# Altium schematic sheet Power.SchDoc
size A4; SheetNumber: 5; SheetTotal: 5
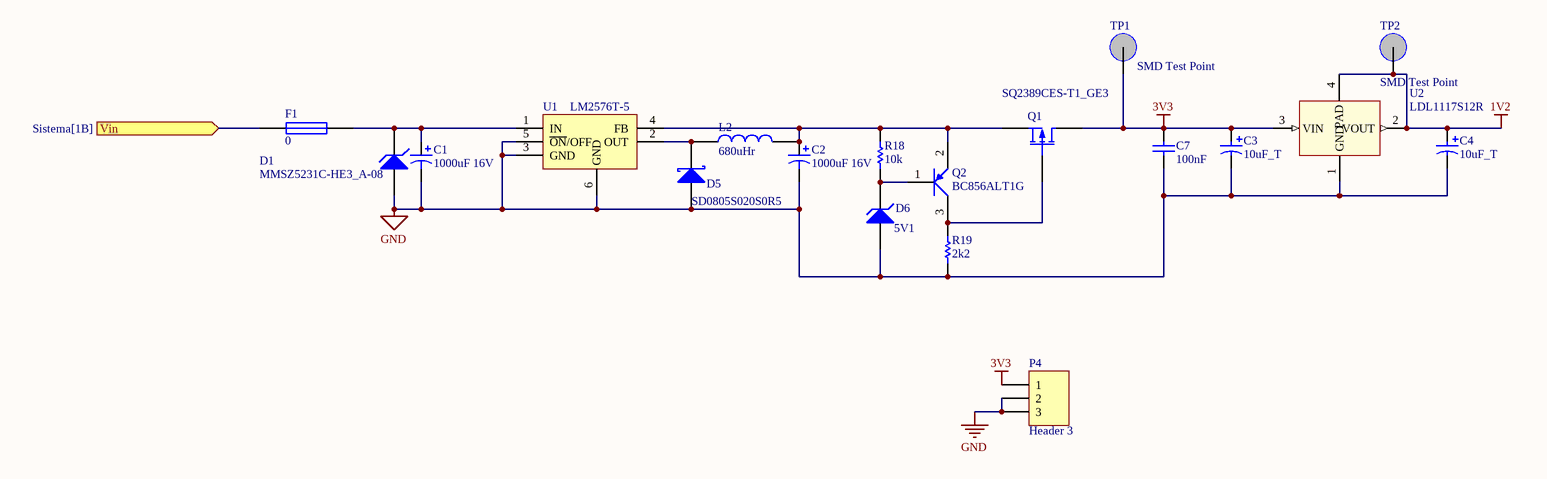
[diagram p0: Power.SchDoc]

## Parts
C1  1000uF 16V  [C_SMD_F12]
C2  1000uF 16V  [C_SMD_F12]
C3  10uF_T  [C_0805_2013_c]
C4  10uF_T  [C_0805_2013_c]
C7  100nF  [C_0805_2013_b]
D1  MMSZ5231C-HE3_A-08  [D_SOD-123]
D5  SD0805S020S0R5  [D_SOD-123]
D6  5V1  [D_SOD-123]
F1  0  [F_0805_2012]
L2  680uHr  [L_SMD_10x10]
P4  Header 3  [P_HDR1X3_3D]
Q1  SQ2389CES-T1_GE3  [Q_SOT-23]
Q2  BC856ALT1G  [Q_SOT-23B_N]
R18  10k  [R_0805_2012_a]
R19  2k2  [R_0805_2012_a]
TP1  SMD Test Point  [TP SMD]
TP2  SMD Test Point  [TP SMD]
U1  LM2576T-5  [U_SMD_TO-263-5]
U2  LDL1117S12R  [U_SOT-223]

## Ports
Vin (in, see Sistema[1B])

## Nets
1V2: C4.1 TP2.1 U2.2(VOUT) U2.4(PAD)
3V3: C3.1 C7.2 P4.1 Q1.3(D) TP1.1 U2.3(VIN)
GND: C1.2 C2.2 C3.2 C4.2 C7.1 D1.2(A) D5.2(A) D6.2(A) P4.2 P4.3 R19.2 U1.3(GND) U1.5(~{O}~{N}/OFF) U1.6(GND) U2.1(GND)
Vin: F1.1 ; port Vin
NetC1_1: C1.1 D1.1(K) F1.2 U1.1(IN)
NetC2_1: C2.1 L2.2 Q1.2(S) Q2.2(E) R18.2 U1.4(FB)
NetD5_1: D5.1(K) L2.1 U1.2(OUT)
NetD6_1: D6.1(K) Q2.1(B) R18.1
NetQ1_1: Q1.1(G) Q2.3(C) R19.1

## Library data of the parts
C1 C2 = C_1000uF_16V_p: Capacitor SMD Elec F12; Manufacturer: KEMET; Manufacturer Part Number: A768MS108M1CLAE015; Supplier 1: Mouser; Supplier Part Number 1: 80-A768MS108M1CLAE15; RoHS: Yes; Category: Polymer Capacitors; Stock 1: 5839; Pricing 1: 1=0,91, 10=0,572, 50=0,572, 100=0,466, 1000=0,307, 10000=0,275 (USD); Value: 1000uF 16V
C3 C4 = C_10uF_10V_b: Capacitor SMD 0805 Tant; Manufacturer: Vishay; Manufacturer Part Number: TMCP1A106MTRF; RoHS Compliant: Yes; Supplier 1: Mouser; Supplier Part Number 1: 74-TMCP1A106MTRF; RoHS: Yes; Category: Tantalum Capacitors; Stock 1: 7293; Pricing 1: 1=0,3, 10=0,152, 50=0,152, 100=0,098, 1000=0,082, 10000=0,067 (USD); Value: 10uF_T
C7 = C_100nF_50V_b: Capacitor SMD 0805; Manufacturer: Yageo; Manufacturer Part Number: CC0805KRX7R9BB104; Material: Ceramic; Tolerance: 10%; Dielectric: X7R; Voltage: 50V; Insulation Resistance: 100GR; Mounting Technology: Surface Mount; Case/Package: 0805; Pins: 2; Case Code (Metric): 2012; Case Code (Imperial): 0805; Min Operating Temperature: -55°C; Max Operating Temperature: 125°C; Packaging: Tape and Reel; Voltage Rating: 50V; Package Quantity: 4000; Termination: SMD/SMT; Series: CC; Length: 2mm; Height: 0.85mm; Depth: 1.25mm; Radiation Hardening: No; RoHS Compliant: Yes; Reach SVHC Compliant: No; Halogen Free: 5694HalogenFree; Lead Free: 5697LeadFree; ComponentLink1URL: https://datasheet.ciiva.com/11786/0900766b80d84f1d-11786009.pdf?src-supplier=Rs; ComponentLink1Description: https://datasheet.ciiva.com/11786/0900766b80d84f1d-11786009.pdf?src-supplier=Rs; ComponentLink2URL: https://datasheet.ciiva.com/46393/1734573-46393307.pdf?src-supplier=Element14; ComponentLink2Description: https://datasheet.ciiva.com/46393/1734573-46393307.pdf?src-supplier=Element14; ComponentLink3URL: https://datasheet.ciiva.com/155/mlccorderingcode-155930.pdf?src-supplier=Digikey; ComponentLink3Description: https://datasheet.ciiva.com/155/mlccorderingcode-155930.pdf?src-supplier=Digikey; ComponentLink4URL: https://datasheet.ciiva.com/155/mlccorderingcode-155929.pdf?src-supplier=Digikey; ComponentLink4Description: https://datasheet.ciiva.com/155/mlccorderingcode-155929.pdf?src-supplier=Digikey; ComponentLink5URL: https://datasheet.ciiva.com/155/mlccorderingcode-155931.pdf?src-supplier=Digikey; ComponentLink5Description: https://datasheet.ciiva.com/155/mlccorderingcode-155931.pdf?src-supplier=Digikey; ComponentLink6URL: https://datasheet.ciiva.com/11464/upy-gphc-x7r-6-3v-to-50v-8-11464757.pdf?src-supplier=Avnet; ComponentLink6Description: https://datasheet.ciiva.com/11464/upy-gphc-x7r-6-3v-to-50v-8-11464757.pdf?src-supplier=Avnet; ComponentLink7URL: https://datasheet.ciiva.com/28450/1489800-28450805.pdf?src-supplier=Element14; ComponentLink7Description: https://datasheet.ciiva.com/28450/1489800-28450805.pdf?src-supplier=Element14; ComponentLink8URL: https://datasheet.ciiva.com/29242/445210-da-01-en-kerko-chip-0805-x7r-0-1uf-10proz-50vg-29242074.pdf?src-supplier=Conrad; ComponentLink8Description: https://datasheet.ciiva.com/29242/445210-da-01-en-kerko-chip-0805-x7r-0-1uf-10proz-50vg-29242074.pdf?src-supplier=Conrad; Supplier 1: Digikey; Supplier Part Number 1: 311-1140-1-ND; RoHS: Yes; Category: Ceramic Capacitors; Stock 1: 5306374; Pricing 1: 1=0,1, 10=0,07, 50=0,0418, 100=0,0329, 500=0,02428, 1000=0,0201 (USD); Value: 100nF
D1 = D_MMSZ5231C-HE3_A-08: Diode SMD SOD-123 Zener 5V1; Manufacturer: Vishay Semiconductors; Manufacturer Part Number: MMSZ5226C-E3-08; Zener Voltage: 3.3V; Max Power Dissipation: 500mW; Impedance: 28R; Zener Current: 20mA; Voltage Tolerance: 2%; Max Reverse Leakage Current: 25uA; Mounting Technology: Surface Mount; Weight: 0.000363oz; Min Operating Temperature: -55°C; Max Operating Temperature: 150°C; Packaging: Tape and Reel; Package Quantity: 3000; Power Dissipation: 500mW; Tolerance: 2%; Series: Automotive, AEC-Q101; RoHS Compliant: Yes; ComponentLink1URL: https://www.vishay.com/docs/86344/mmsz5225_to_mmsz5267.pdf; ComponentLink1Description: Datasheet; RoHS: Yes; Category: Zener Diodes; Stock 1: 14347; Pricing 1: 1=0,29, 10=0,198, 50=0,198, 100=0,089, 1000=0,062, 10000=0,041 (USD); Value: MMSZ5231C-HE3_A-08; Supplier 1: Mouser; Supplier Part Number 1: 78-MMSZ5231CHE3_A-08
D5 = D_SD0805S020S0R5: Diode SMD D_SD0805S020S0R5; Manufacturer: Diodes; Manufacturer Part Number: B550C-13-F; Max Reverse Current: 500uA; Forward Current: 5A; Max Repetitive Reverse Voltage (Vrrm): 50V; Peak Non-Repetitive Surge Current: 100A; Polarity: Standard; Forward Voltage: 700mV; Mounting Technology: Surface Mount; Case/Package: SMC; Pins: 2; Weight: 0.007408oz; Contact Plating: Tin,Matte; Min Operating Temperature: -55°C; Max Operating Temperature: 125°C; Package Quantity: 3000; Packaging: Tape and Reel; Current Rating: 5A; Output Current: 5A; Series: -; Average Rectified Current: 5A; Max Forward Surge Current (Ifsm): 100A; Termination: SMD/SMT; Voltage Rating (DC): 50V; Max Reverse Voltage (DC): 50V; Length: 7.11mm; Width: 6.22mm; Height: 2.5mm; Radiation Hardening: No; Lead Free: Lead Free; RoHS Compliant: Yes; Reach SVHC Compliant: No; RoHS: Yes; Category: Rectifier Diodes; Stock 1: 65197; Pricing 1: 1=0,56, 10=0,476, 100=0,3309, 500=0,25834, 1000=0,20998 (USD); Value: SD0805S020S0R5; Supplier 1: Digikey; Supplier Part Number 1: 478-7799-1-ND
D6 = D_DDZ5V1B-7: Zener Diode; Manufacturer: Diodes; Max Power Dissipation: 500mW; Zener Voltage: 5.1V; Max Reverse Leakage Current: 5uA; Tolerance: 3%; Forward Voltage: 900mV; Impedance: 17R; Test Current: 20mA; Output Current: 40mA; Mounting Technology: Surface Mount; Case/Package: SOD-123-2; Pins: 2; Weight: 0.000353oz; Min Operating Temperature: -65°C; Max Operating Temperature: 150°C; Package Quantity: 3000; Packaging: Tape and Reel; Voltage Tolerance: 3%; Power Rating: 500mW; Series: -; Zener Current: 5uA; Max Reverse Current: 5uA; Power Dissipation: 500mW; Working Voltage: 5.1V; Termination: SMD/SMT; Voltage Rating (DC): 5.1V; Length: 3.85mm; Width: 1.7mm; Height: 1.35mm; Radiation Hardening: No; RoHS Compliant: Yes; Lead Free: Lead Free; ComponentLink1URL: http://components.arrow.com/part/dataview/41508659S7354897N2868?src-supplier=Arrow+Electronics; ComponentLink1Description: http://components.arrow.com/part/dataview/41508659S7354897N2868?src-supplier=Arrow+Electronics; ComponentLink2URL: http://www.mouser.com/ds/2/115/ds30407-71565.pdf?src-supplier=Mouser; ComponentLink2Description: http://www.mouser.com/ds/2/115/ds30407-71565.pdf?src-supplier=Mouser; ComponentLink3URL: http://www.diodes.com///datasheets/ds30407.pdf?src-supplier=Avnet; ComponentLink3Description: http://www.diodes.com///datasheets/ds30407.pdf?src-supplier=Avnet; ComponentLink4URL: http://www.diodes.com//datasheets/ds30407.pdf?src-supplier=Avnet; ComponentLink4Description: http://www.diodes.com//datasheets/ds30407.pdf?src-supplier=Avnet; ComponentLink5URL: https://datasheet.octopart.com/DDZ5V1B-7-Diodes-Inc.-datasheet-160462869.pdf?src-supplier=Farnell; ComponentLink5Description: https://datasheet.octopart.com/DDZ5V1B-7-Diodes-Inc.-datasheet-160462869.pdf?src-supplier=Farnell; ComponentLink6URL: http://www.diodes.com/_files/datasheets/ds30407.pdf?src-supplier=Future+Electronics; ComponentLink6Description: http://www.diodes.com/_files/datasheets/ds30407.pdf?src-supplier=Future+Electronics; ComponentLink7URL: https://www.diodes.com/assets/Datasheets/Ds30407.pdf?src-supplier=Digikey; ComponentLink7Description: https://www.diodes.com/assets/Datasheets/Ds30407.pdf?src-supplier=Digikey; ComponentLink8URL: https://datasheet.octopart.com/DDZ5V1B-7-Diodes-Inc.-datasheet-22952792.pdf?src-supplier=Future+Electronics; ComponentLink8Description: https://datasheet.octopart.com/DDZ5V1B-7-Diodes-Inc.-datasheet-22952792.pdf?src-supplier=Future+Electronics; ComponentLink9URL: https://www.verical.com/server-webapp/html/getDatasheet?partID=95733&src-supplier=Verical; ComponentLink9Description: https://www.verical.com/server-webapp/html/getDatasheet?partID=95733&src-supplier=Verical; Supplier 1: Digikey; Supplier Part Number 1: DDZ5V1BDICT-ND; Manufacturer Part Number: DDZ5V1B-7; RoHS: Yes; Category: Zener Diodes; Stock 1: 88257; Pricing 1: 1=0,25, 10=0,172, 100=0,084, 500=0,07006, 1000=0,04868 (USD); Supplier 2: Mouser; Supplier Part Number 2: 621-DDZ5V1B-7; Stock 2: 108934; Pricing 2: 1=0,24, 10=0,161, 50=0,161, 100=0,084, 1000=0,048, 10000=0,028 (USD); Value: 5V1
F1 = F_?_0805: (Generico) Fuse SMD 0805; Origin: TAIWAN; Published: 8-Jun-2000; LatestRevisionDate: 17-Jul-2002; LatestRevisionNote: Re-released for DXP Platform.; PackageReference: PIN-W2/E2.8; Publisher: Altium Limited; PackageDescription: Thru-Hole; 2 Leads; Supplier 1: Digi-Key; Supplier Part Number 1: SF-1206S200-2CT-ND; Value: 0
L2 = L_?_5: (Generico)  Inductor SMD 10x10; Value: 0
P4 = P_Header 3: Header, 3-Pin; Value: Header 3
Q1 = Q_SQ2389CES-T1_GE3: Value: SQ2389CES-T1_GE3; Supplier 1: Mouser; Supplier Part Number 1: 78-SQ2389CES-T1_GE3
Q2 = Q_BC856: TRANS PNP 65V 0.1A SOT23; Manufacturer: ON Semiconductor; Max Power Dissipation: 300mW; Max Collector Current: 100mA; Transition Frequency: 100MHz; Emitter Base Voltage (VEBO): 5V; Collector Base Voltage (VCBO): 80V; Collector Emitter Saturation Voltage: -650mV; Collector-emitter Voltage-Max: 650mV; hFE Min: 125; Number of Elements: 1; Voltage Rating (DC): -65V; Current Rating: -100mA; ComponentLink1Description: Manufacturer Link; ComponentLink1URL: http://www.fairchildsemi.com/; ComponentLink2Description: Datasheet; ComponentLink2URL: http://www.fairchildsemi.com/ds/2N%2F2N3904.pdf; Case/Package: SOT-23-3; Pins: 3; Contact Plating: Tin,Matte; Min Operating Temperature: -55°C; Max Operating Temperature: 150°C; Package Quantity: 3000; Packaging: Tape and Reel; Collector Emitter Breakdown Voltage: 65V; Polarity: PNP; Clock Frequency: 100MHz; Gain Bandwidth Product: 100MHz; Series: -; Collector Emitter Voltage (VCEO): 65V; Frequency: 100MHz; Max Breakdown Voltage: 65V; Power Dissipation: 300mW; Length: 2.9mm; Width: 1.3mm; Height: 0.94mm; Radiation Hardening: No; Lead Free: Lead Free; RoHS Compliant: Yes; Reach SVHC Compliant: No; ComponentLink3URL: http://www.farnell.com/datasheets/1840529.pdf?src-supplier=Farnell; ComponentLink3Description: http://www.farnell.com/datasheets/1840529.pdf?src-supplier=Farnell; ComponentLink4URL: http://www.alliedelec.com/m/d/ae2fff4c1f3549b23e4cd9e6cc054b51.pdf?src-supplier=Allied+Electronics; ComponentLink4Description: http://www.alliedelec.com/m/d/ae2fff4c1f3549b23e4cd9e6cc054b51.pdf?src-supplier=Allied+Electronics; ComponentLink5URL: http://www.mouser.com/ds/2/308/BC856ALT1-D-249456.pdf?src-supplier=Mouser; ComponentLink5Description: http://www.mouser.com/ds/2/308/BC856ALT1-D-249456.pdf?src-supplier=Mouser; ComponentLink6URL: http://www.farnell.com/datasheets/1840529.pdf?src-supplier=Element14; ComponentLink6Description: http://www.farnell.com/datasheets/1840529.pdf?src-supplier=Element14; ComponentLink7URL: http://www.farnell.com/datasheets/1840529.pdf?src-supplier=Newark; ComponentLink7Description: http://www.farnell.com/datasheets/1840529.pdf?src-supplier=Newark; Supplier Part Number 1: 863-BC856ALT1G; Manufacturer Part Number: BC856ALT1G; RoHS: Yes; Category: BJTs; Stock 1: 30566; Pricing 1: 1=0,11, 10=0,071, 50=0,071, 100=0,034, 1000=0,021, 10000=0,015 (USD); Value: BC856ALT1G; Supplier 1: Mouser
R18 = R_10k_b: Resistor SMD 0805; Manufacturer: Yageo; Manufacturer Part Number: AC0805FR-0710KL; Tolerance: 1%; Power Rating: 125mW; Voltage Rating: 150V; Temperature Coefficient: 100ppm/°C; Case/Package: 0805; Case Code (Metric): 2012; Case Code (Imperial): 0805; Min Operating Temperature: -55°C; Max Operating Temperature: 155°C; Packaging: Tape and Reel; Package Quantity: 1; Number of Terminations: 2; Termination: SMD/SMT; Max Power Dissipation: 125mW; Features: Moisture Resistant,Automotive AEC-Q200,Anti-Sulfur; Series: AC; Construction: Rectangular; Length: 0.079inch; Width: 0.049inch; Height: 0.024inch; Depth: 1.25mm; Military Standard: Not; Lead Free: Lead Free; RoHS Compliant: Yes; ComponentLink1URL: http://www.yageo.com/NewPortal/yageodocoutput?fileName=/pdf/R-Chip/PYu-AC_51_RoHS_L_6.pdf&src-supplier=Digikey; ComponentLink1Description: http://www.yageo.com/NewPortal/yageodocoutput?fileName=/pdf/R-Chip/PYu-AC_51_RoHS_L_6.pdf&src-supplier=Digikey; ComponentLink2URL: http://www.yageo.com/documents/recent/PYu-AC_51_RoHS_L_2_revised.pdf?src-supplier=Future+Electronics; ComponentLink2Description: http://www.yageo.com/documents/recent/PYu-AC_51_RoHS_L_2_revised.pdf?src-supplier=Future+Electronics; ComponentLink3URL: http://www.yageo.com/NewPortal/yageodocoutput?fileName=/pdf/R-Chip/PYu-AC_51_RoHS_L_6.pdf&src-supplier=NAC+Semi; ComponentLink3Description: http://www.yageo.com/NewPortal/yageodocoutput?fileName=/pdf/R-Chip/PYu-AC_51_RoHS_L_6.pdf&src-supplier=NAC+Semi; ComponentLink4URL: http://www.yageo.com/NewPortal/yageodocoutput?fileName=/pdf/R-Chip/PYu-AC_51_RoHS_L_6.pdf&src-supplier=Rutronik; ComponentLink4Description: http://www.yageo.com/NewPortal/yageodocoutput?fileName=/pdf/R-Chip/PYu-AC_51_RoHS_L_6.pdf&src-supplier=Rutronik; Supplier 1: Digikey; Supplier Part Number 1: 311-10KLGCT-ND; RoHS: Yes; Category: Chip SMD Resistors; Stock 1: 480247; Pricing 1: 1=0,1, 10=0,031, 50=0,0198, 100=0,0166, 500=0,01152, 1000=0,00997 (USD); Value: 10k
R19 = R_2k2_b: Resistor SMD 0805; Manufacturer: Bourns; Manufacturer Part Number: CR0805-FX-2201ELF; Voltage Rating: 150V; Tolerance: 1%; Power Rating: 125mW; Temperature Coefficient: 100ppm/°C; Mounting Technology: Surface Mount; Case/Package: 0805; Contact Plating: Tin; Case Code (Imperial): 0805; Case Code (Metric): 2012; Min Operating Temperature: -55°C; Max Operating Temperature: 155°C; Packaging: Tape and Reel; Package Quantity: 5000; Termination: SMD/SMT; Series: CR0805; Resistor Type: Thick Film; Voltage Rating (DC): 150V; Resistance Tolerance: 1%; Length: 2mm; Width: 1.25mm; Height: 0.5mm; Thickness: 508um; Radiation Hardening: No; RoHS Compliant: Yes; Reach SVHC Compliant: No; ComponentLink1URL: https://datasheet.ciiva.com/22713/691949-22713256.pdf?src-supplier=Element14; ComponentLink1Description: https://datasheet.ciiva.com/22713/691949-22713256.pdf?src-supplier=Element14; ComponentLink2URL: https://datasheet.ciiva.com/5541/chpreztr-5541000.pdf?src-supplier=Mouser; ComponentLink2Description: https://datasheet.ciiva.com/5541/chpreztr-5541000.pdf?src-supplier=Mouser; Supplier 1: Digikey; Supplier Part Number 1: 118-CR0805-FX-2201ELFCT-ND; RoHS: Yes; Category: Chip SMD Resistors; Stock 1: 80126; Pricing 1: 1=0,1, 10=0,021, 50=0,0132, 100=0,011, 500=0,00744, 1000=0,00639 (USD); Value: 2k2
TP1 TP2 = P_T_TP: Test Point SMD; Origin: CHINA; Published: 8-Jun-2000; LatestRevisionDate: 17-Jul-2002; LatestRevisionNote: Re-released for DXP Platform.; PackageReference: AXIAL-0.3; Publisher: Altium Limited; PackageDescription: Axial Device, Thru-Hole; 2 Leads; 0.3 in Pin Spacing; Supplier 1: Mouser; Supplier Part Number 1: 279-RCT-0C; Type: CONNECTOR; Value: SMD Test Point
U1 = U_LM2576-3.3WU: Value: LM2576T-5; Supplier 1: Mouser; Supplier Part Number 1: 998-LM2576-3.3WUTR
U2 = U_LDL1117: LDL1117 Series 1.2 A 2.5 V High PSRR LDO Linear Voltage Regulator-SOT-223; Manufacturer: STMicroelectronics; Manufacturer Part Number: LDL1117S25R; Output Type: Fixed; Output Configuration: Positive; Number of Regulators: 1; Max Supply Voltage: 18V; Min Output Voltage: 2.5V; Output Current: 1.2A; Quiescent Current: 500uA; Power Supply Rejection Ratio (PSRR): 65dB; Accuracy: 2%; Min Supply Voltage: 2.6V; Nominal Supply Current: 250uA; Number of Channels: 1NUMBER; Value: LDL1117S25R; Mounting Technology: Surface Mount; Case/Package: TO-261-4; Min Operating Temperature: -40°C; Max Operating Temperature: 125°C; Packaging: Cut Tape; Series: -; Number of Outputs: 1NUMBER; Output Voltage: 2.5V; Height: 1.8mm; RoHS Compliant: Yes; ComponentLink1URL: http://www.farnell.com/datasheets/2342741.pdf?src-supplier=Farnell; ComponentLink1Description: http://www.farnell.com/datasheets/2342741.pdf?src-supplier=Farnell; ComponentLink2URL: http://www.st.com/content/ccc/resource/technical/document/datasheet/group3/0e/5a/00/ca/10/1a/4f/a5/DM00366442/files/DM00366442.pdf/jcr:content/translations/en.DM00366442.pdf?src-supplier=Digikey; ComponentLink2Description: http://www.st.com/content/ccc/resource/technical/document/datasheet/group3/0e/5a/00/ca/10/1a/4f/a5/DM00366442/files/DM00366442.pdf/jcr:content/translations/en.DM00366442.pdf?src-supplier=Digikey; ComponentLink3URL: https://datasheet.octopart.com/LDL1117S25R-STMicroelectronics-datasheet-165583407.pdf?src-supplier=TME; ComponentLink3Description: https://datasheet.octopart.com/LDL1117S25R-STMicroelectronics-datasheet-165583407.pdf?src-supplier=TME; Supplier 1: Mouser; Supplier Part Number 1: 511-LDL1117S25R; RoHS: Yes; Category: Voltage Regulators - Linear; Stock 1: 10345; Pricing 1: 1=1,1, 10=0,98, 50=0,935, 100=0,757, 1000=0,478, 10000=0,415 (USD)